# EAGLE design atividade3 (EAGLE 9.6.2)
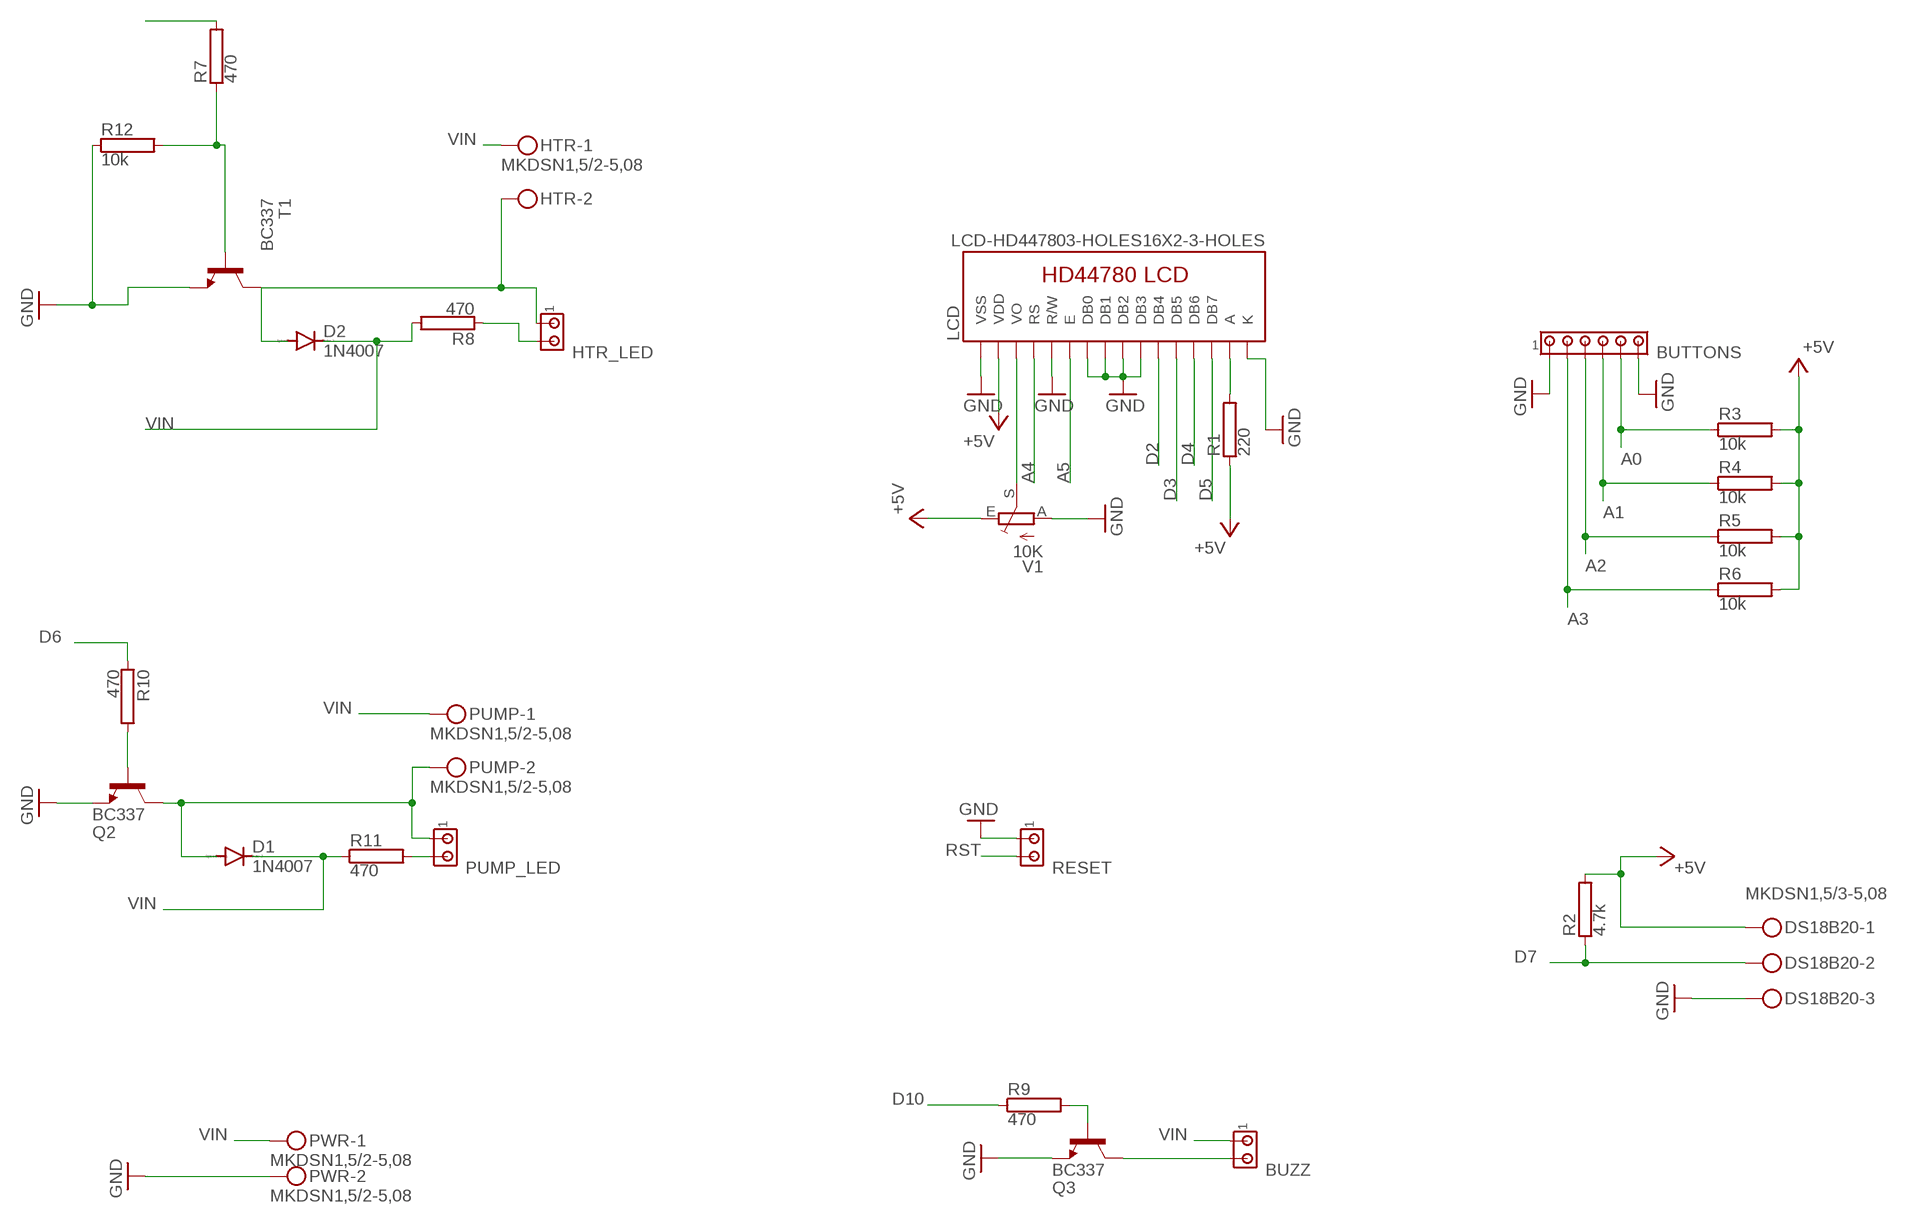
[diagram p0: schematic, sheet 1]

## Parts
BUTTONS  MTA06-100  [10X06MTA]
BUZZ  MTA02-100  [10X02MTA]
D1  1N4007  1N4004  [DO41-10]
D2  1N4007  1N4004  [DO41-10]
DS18B20  MKDSN1,5/3-5,08  [MKDSN1,5/3-5,08]
HTR  MKDSN1,5/2-5,08  [MKDSN1,5/2-5,08]
HTR_LED  MTA02-100  [10X02MTA]
LCD  LCD-HD447803-HOLES16X2-3-HOLES  [LCD-16X2-3HOLES]
PUMP  MKDSN1,5/2-5,08  [MKDSN1,5/2-5,08]
PUMP_LED  MTA02-100  [10X02MTA]
PWR  MKDSN1,5/2-5,08  [MKDSN1,5/2-5,08]
Q2  BC337  [TO92]
Q3  BC337  [TO92]
R1  220  RRS1/8  [RS1/8]
R2  4.7k  RRS1/8  [RS1/8]
R3  10k  RRS1/8  [RS1/8]
R4  10k  RRS1/8  [RS1/8]
R5  10k  RRS1/8  [RS1/8]
R6  10k  RRS1/8  [RS1/8]
R7  470  RRS1/8  [RS1/8]
R8  470  RRS1/8  [RS1/8]
R9  470  RRS1/8  [RS1/8]
R10  470  RRS1/8  [RS1/8]
R11  470  RRS1/8  [RS1/8]
R12  10k  RRS1/8  [RS1/8]
RESET  MTA02-100  [10X02MTA]
T1  BC337  [TO92]
V1  10K  TRIM_EU-B25P  [B25P]

## Nets
+5V: DS18B20.1 LCD.2(VDD) R1.1 R2.2 R3.2 R4.2 R5.2 R6.2
+5V1: V1.E ; supply symbol labelled +5V
A0: BUTTONS.5 R3.1
A1: BUTTONS.4 R4.1
A2: BUTTONS.3 R5.1
A3: BUTTONS.2 R6.1
A4: LCD.4(RS)
A5: LCD.6(E)
D2: LCD.11(DB4)
D3: LCD.12(DB5)
D4: LCD.13(DB6)
D5: LCD.14(DB7)
D6: R10.1
D7: DS18B20.2 R2.1
D9: R7.2
D10: R9.1
GND: BUTTONS.1 BUTTONS.6 DS18B20.3 LCD.1(VSS) LCD.5(R/W) LCD.7(DB0) LCD.8(DB1) LCD.9(DB2) LCD.10(DB3) LCD.16(K) PWR.2 Q2.1(E) Q3.1(E) R12.1 RESET.1 T1.1(E) V1.A
N$1: R7.1 R12.2 T1.2(B)
N$2: D2.A HTR.2 HTR_LED.1 T1.3(C)
N$3: D2.C R8.2
N$4: HTR_LED.2 R8.1
N$5: Q2.2(B) R10.2
N$6: Q3.2(B) R9.2
N$7: LCD.15(A) R1.2
N$8: PUMP_LED.2 R11.2
N$9: BUZZ.2 Q3.3(C)
N$10: LCD.3(VO) V1.S
PUMP: D1.A PUMP.2 PUMP_LED.1 Q2.3(C)
RST: RESET.2
VIN: BUZZ.1 D1.C HTR.1 PUMP.1 PWR.1 R11.1

## Library data of the parts
BUTTONS = con-amp:MTA06-100: AMP connector Connection corrected 2014-09-19
BUZZ PUMP_LED RESET = con-amp:MTA02-100: AMP connector
D1 = diode:1N4004: DIODE general purpose rectifier, 1 A
D2 = diode:1N4004: DIODE general purpose rectifier, 1 A; SPICEPREFIX: B
DS18B20 = con-phoenix-508:MKDSN1,5/3-5,08: MKDSN 1,5/ 3-5,08 Printklemme Nennstrom: 13,5 A Nennspannung: 250 V Rastermaß: 5,08 mm Polzahl: 3 Anschlussart: Schraubanschluss Montage: Löten Anschlussrichtung Leiter/Platine: 0 ° Artikelnummer: 1729131 Source: http://eshop.phoenixcontact.com .. 1729131.pdf
HTR = con-phoenix-508:MKDSN1,5/2-5,08: MKDSN 1,5/ 2-5,08 Printklemme Nennstrom: 13,5 A Nennspannung: 250 V Rastermaß: 5,08 mm Polzahl: 2 Anschlussart: Schraubanschluss Montage: Löten Anschlussrichtung Leiter/Platine: 0 ° Artikelnummer: 1729128 Source: http://eshop.phoenixcontact.com .. 1729128.pdf; SPICEPREFIX: X
HTR_LED = con-amp:MTA02-100: AMP connector; SPICEPREFIX: H
LCD = HD44780LCD:LCD-HD44780
PUMP PWR = con-phoenix-508:MKDSN1,5/2-5,08: MKDSN 1,5/ 2-5,08 Printklemme Nennstrom: 13,5 A Nennspannung: 250 V Rastermaß: 5,08 mm Polzahl: 2 Anschlussart: Schraubanschluss Montage: Löten Anschlussrichtung Leiter/Platine: 0 ° Artikelnummer: 1729128 Source: http://eshop.phoenixcontact.com .. 1729128.pdf
Q2 Q3 = transistor-npn:BC337*: NPN Transistor
R1-R6 R9-R11 = resistor-power:R: Power Resitor; OC_FARNELL: unknown; OC_NEWARK: unknown
R7 R8 R12 = resistor-power:R: Power Resitor; OC_FARNELL: unknown; OC_NEWARK: unknown; SPICEPREFIX: R
T1 = transistor:BC337: NPN TRANSISTOR; SPICEPREFIX: J
V1 = pot:TRIM_EU-: POTENTIOMETER

## Board
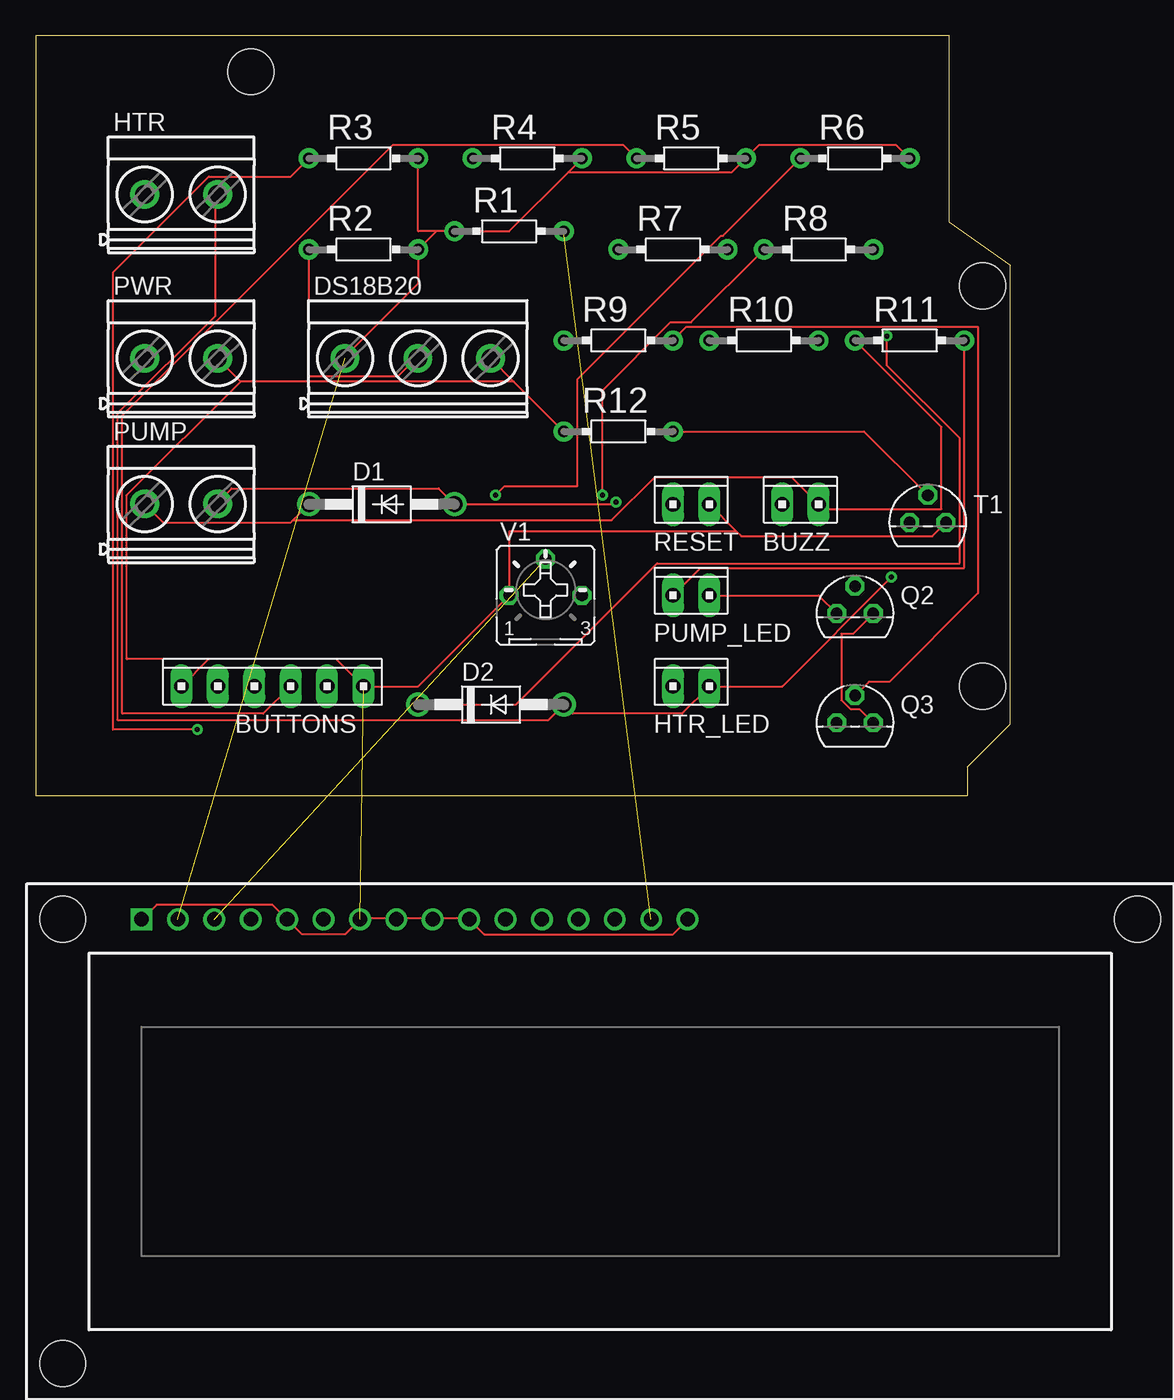
[diagram p1: board, top side]
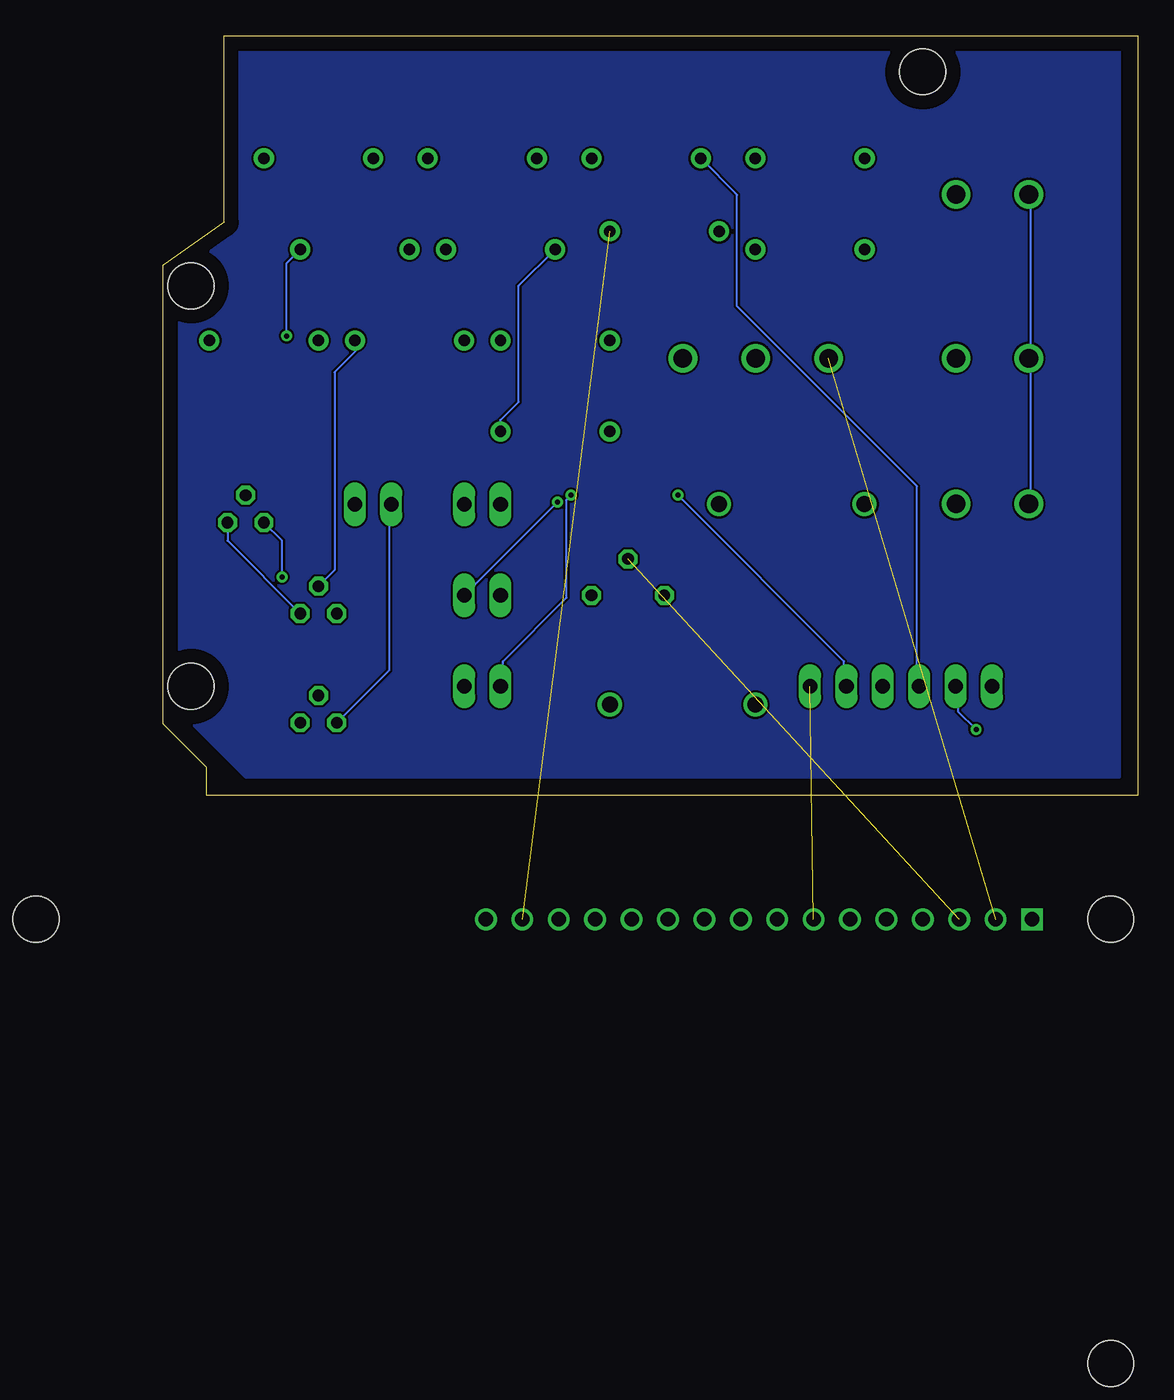
[diagram p2: board, bottom side, seen from below]

Size 68 x 53 mm. Coordinates in mm from the lower left corner, seen from the top.
Outline: 0,0 65,0 65,2 68,5 68,37 63.73,40 63.73,53 0,53 0,0
Copper layers (1*16): Top 0.035mm / dielectric 1.5mm / Bottom 0.035mm
Design rules "default": minimum track width 6mil, minimum drill 0.35mm, track to track 6mil, track to pad 6mil, pad to pad 6mil, via to via 6mil, smd to smd 6mil, copper to edge 40mil, drill to drill 6mil, minimum pad ring 10mil, minimum via ring 8mil, stop-mask expansion 4mil, vias tented up to drill 0mil, thermal gap 10mil
Holes 3.2 mm at 15,50.5 66.04,35.56 66.04,7.62

### Footprints (pad centres in the part's own frame; a part is rotated, then mirrored left to right if it is on the bottom)
10X06MTA = drill 1.016 long: 1 6.35,0; 2 3.81,0; 3 1.27,0; 4 -1.27,0; 5 -3.81,0; 6 -6.35,0
10X02MTA = drill 1.016 long: 1 1.27,0; 2 -1.27,0
DO41-10 = drill 1.118: A 5.08,0; C -5.08,0
MKDSN1,5/3-5,08 = drill 1.3 pad 2: 1 -7.641,0.025; 2 -2.561,0.025; 3 2.519,0.025
MKDSN1,5/2-5,08 = drill 1.3 pad 2: 1 -2.561,0.025; 2 2.519,0.025
LCD-16X2-3HOLES = drill 1.016 square: 1 -32,15.5 | drill 1.016: 2 -29.46,15.5; 3 -26.92,15.5; 4 -24.38,15.5; 5 -21.84,15.5; 6 -19.3,15.5; 7 -16.76,15.5; 8 -14.22,15.5; 9 -11.68,15.5; 10 -9.14,15.5; 11 -6.6,15.5; 12 -4.06,15.5; 13 -1.52,15.5; 14 1.02,15.5; 15 3.56,15.5; 16 6.1,15.5 | hole 3.2: -37.5,15.5; -37.5,-15.5; 37.5,15.5
TO92 = drill 0.813 octagon: 1 1.27,0; 2 0,1.905; 3 -1.27,0
RS1/8 = drill 0.8 pad 1.4: 1 -3.81,0; 2 3.81,0
B25P = drill 0.813 octagon: A -2.54,0; E 2.54,0; S 0,2.54

### Placement (x,y rotation side)
BUTTONS  16.51,7.62 0 top
BUZZ  53.34,20.32 0 top
D1  24.13,20.32 0 top
D2  31.75,6.35 0 top
DS18B20  29.21,30.48 0 top
HTR  10.16,41.91 0 top
HTR_LED  45.72,7.62 0 top
LCD  39.37,-24.13 0 top  (outside the outline)
PUMP  10.16,20.32 0 top
PUMP_LED  45.72,13.97 0 top
PWR  10.16,30.48 0 top
Q2  57.15,12.7 0 top
Q3  57.15,5.08 0 top
R1  33.02,39.37 0 top
R2  22.86,38.1 0 top
R3  22.86,44.45 0 top
R4  34.29,44.45 0 top
R5  45.72,44.45 0 top
R6  57.15,44.45 0 top
R7  44.45,38.1 0 top
R8  54.61,38.1 0 top
R9  40.64,31.75 0 top
R10  50.8,31.75 0 top
R11  60.96,31.75 0 top
R12  40.64,25.4 0 top
RESET  45.72,20.32 0 top
T1  62.23,19.05 0 top
V1  35.56,13.97 0 top

### Tracks (layer width: path | path; a pad name or v marks a point on that pad's centre or on a via)
+5V  (1 unrouted)
  Top 0.152: 27.94,39.37 R2.2 26.67,35.72 21.59,30.64 DS18B20.1 | 27.94,39.37 R1.1 33.02,39.37 37.15,43.5 | R3.2 26.67,39.37 27.94,39.37 | 37.15,43.5 R4.2 | 37.15,43.5 48.58,43.5 R5.2 50.48,45.4 60.01,45.4 R6.2
A0  (via drill 0.35)
  Top 0.152: R3.1 17.78,43.18 12.06,43.18 5.4,36.51 5.4,4.6 v11.27,4.6
  Bottom 0.152: v11.27,4.6 12.54,5.87 12.54,7.46 BUTTONS.5
A1
  Bottom 0.152: R4.1 27.94,41.91 27.94,34.13 15.4,21.59 15.4,7.78 BUTTONS.4
A2
  Top 0.152: R5.1 40.96,45.4 24.92,45.4 6.03,26.51 6.03,5.71 15.88,5.71 BUTTONS.3
A3  (via drill 0.35)
  Top 0.152: R6.1 47.94,39.05 47.78,39.05 37.78,29.05 37.78,21.59 32.7,21.59 v32.07,20.95
  Bottom 0.152: v32.07,20.95 20.48,9.37 20.48,7.78 BUTTONS.2
D7
  Top 0.152: R2.1 19.05,29.21 25.24,29.21 26.51,30.48 DS18B20.2
GND  (1 unrouted)
  Top 0.152: 33.34,28.89 31.75,30.48 DS18B20.3 | 33.34,28.89 R12.1 | 14.29,28.89 12.7,30.48 PWR.2 | 33.34,28.89 14.29,28.89 | 12.06,9.53 BUTTONS.6 | 12.06,9.53 20.95,9.53 BUTTONS.1 26.67,7.62 V1.A 33.02,18.41 48.9,18.41 | Q3.1 57.47,6.03 56.83,6.03 56.2,6.67 56.2,11.27 56.99,11.27 Q2.1 | T1.1 62.55,18.1 49.21,18.1 48.9,18.41 | RESET.1 48.9,18.41 | 14.29,28.89 6.35,20.95 6.35,9.53 12.06,9.53 | LCD.1 7.46,-8.57 8.41,-7.62 16.51,-7.62 17.46,-8.57 LCD.5 17.62,-8.73 18.57,-9.68 21.59,-9.68 22.54,-8.73 LCD.7 22.7,-8.57 25.08,-8.57 LCD.8 25.24,-8.57 27.62,-8.57 LCD.9 27.78,-8.57 30.16,-8.57 LCD.10 30.32,-8.73 31.27,-9.68 44.45,-9.68 45.4,-8.73 LCD.16
  Bottom 0.152: Q2.1 63.5,17.78 T1.1
GND1
  pour Bottom: 1.27,52.07 1.27,1.27 62.23,1.27 67.31,6.35 67.31,35.56 63.5,39.37 63.5,52.07
N$1
  Top 0.152: T1.2 57.79,25.4 R12.2
  Bottom 0.152: R7.1 43.18,35.56 43.18,27.46 44.45,26.19 R12.2
N$2  (via drill 0.35)
  Top 0.152: v59.69,15.24 52.07,7.62 HTR_LED.1 45.09,5.71 37.46,5.71 D2.A 35.72,5.24 5.71,5.24 5.71,26.67 12.54,33.5 12.54,41.91 HTR.2
  Bottom 0.152: T1.3 59.69,17.78 v59.69,15.24
N$3  (via drill 0.35)
  Top 0.152: v59.37,32.07 59.37,30 64.45,24.92 64.45,16.19 43.34,16.19 33.5,6.35 D2.C
  Bottom 0.152: R8.2 59.37,37.15 v59.37,32.07
N$4  (via drill 0.35)
  Top 0.152: R8.1 45.72,33.02 44.29,33.02 39.53,28.26 v39.53,20.95
  Bottom 0.152: v39.53,20.95 39.85,20.64 39.85,13.81 44.29,9.37 44.29,7.78 HTR_LED.2
N$5
  Bottom 0.152: Q2.2 56.04,15.72 56.04,29.53 54.61,30.96 R10.2
N$6
  Top 0.152: Q3.2 58.1,7.94 59.53,7.94 65.72,14.13 65.72,32.7 45.4,32.7 R9.2
N$7  (1 unrouted)
N$8
  Top 0.152: R11.2 64.77,15.87 46.35,15.87 PUMP_LED.2
N$9
  Bottom 0.152: Q3.3 52.23,8.73 52.23,20.16 BUZZ.2
N$10  (1 unrouted)
PUMP  (via drill 0.35)
  Top 0.152: Q2.3 54.61,13.97 PUMP_LED.1 | PUMP.2 12.7,20.48 13.65,21.43 28.1,21.43 D1.A 40.32,20.32 v40.48,20.48
  Bottom 0.152: v40.48,20.48 PUMP_LED.1
VIN
  Top 0.152: R11.1 63.18,25.72 63.18,20 54.93,20 BUZZ.1 52.71,22.23 43.18,22.23 40.16,19.21 17.94,19.21 | 17.94,19.21 17.78,19.05 8.89,19.05 7.62,20.32 PUMP.1 | 17.94,19.21 D1.C
  Bottom 0.152: PUMP.1 7.46,20.48 7.46,30.48 PWR.1 7.46,30.64 7.46,41.91 HTR.1